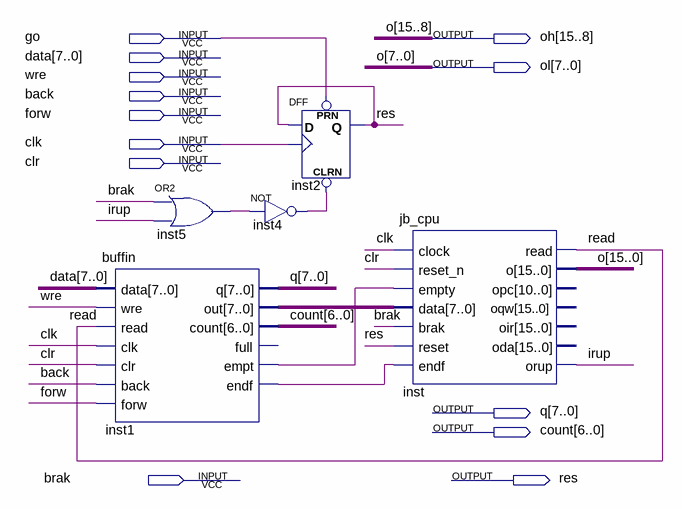
[diagram p0: schematic sheet]
// Quartus schematic top.bdf as structural Verilog: 5 symbols, 13 pins
module top (
  input  go,
  input  [7:0] data,
  input  wre,
  input  back,
  input  forw,
  input  clk,
  input  clr,
  input  brak,
  output [15:8] oh,
  output [7:0] ol,
  output [7:0] q,
  output [6:0] count,
  output res
);

  wire inst1_empt, inst1_endf, inst4_out, inst5_out, irup, read;
  wire [7:0] inst1_out;

  buffin inst1 (
    .data(data), .wre(wre), .read(read), .clk(clk), .clr(clr), .back(back), .forw(forw), .q(q),
    .out(inst1_out), .count(count), .empt(inst1_empt), .endf(inst1_endf));  // open: full
  or inst5 (inst5_out, brak, irup);
  not inst4 (inst4_out, inst5_out);
  DFF inst2 (.CLRN(inst4_out), .CLK(clk), .D(res), .PRN(go), .Q(res));
  jb_cpu inst (
    .clock(clk), .reset_n(clr), .empty(inst1_empt), .data(inst1_out), .brak(brak), .reset(res),
    .endf(inst1_endf), .read(read), .o({oh, ol}), .orup(irup));  // open: opc, oqw, oir, oda

  // Other names for the same wires on the sheet: o[15:0] = {oh, ol}
endmodule
